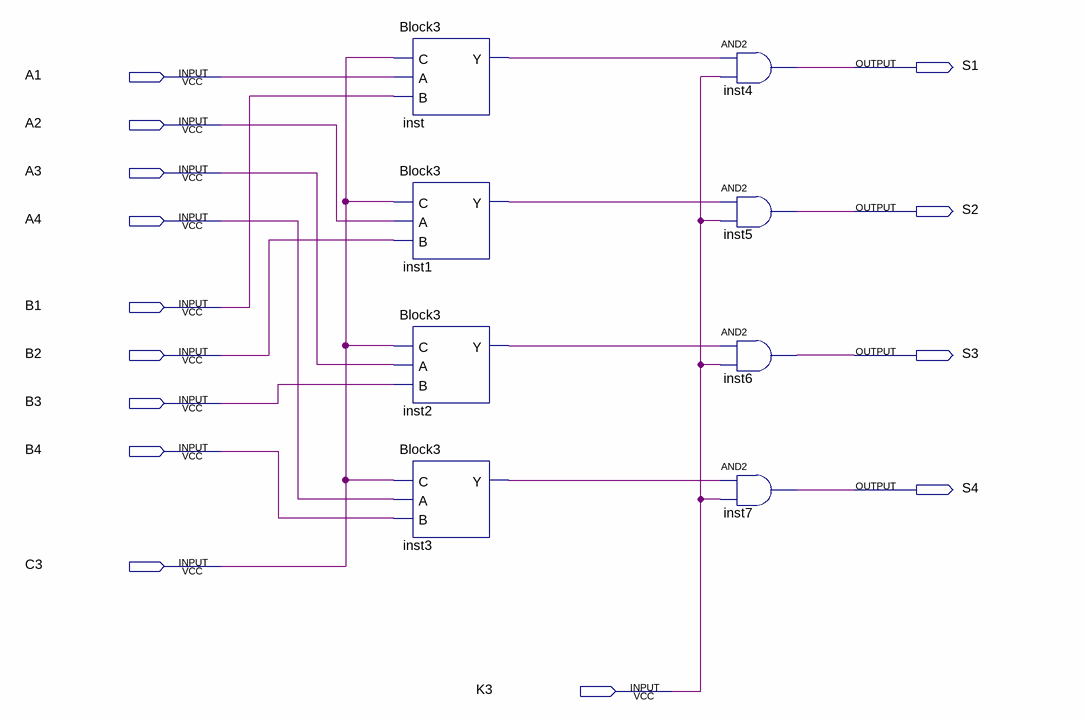
[diagram p0: schematic sheet]
// Quartus schematic Block4.bdf as structural Verilog: 8 symbols, 14 pins
module Block4 (
  input  A1,
  input  A2,
  input  A3,
  input  A4,
  input  B1,
  input  B2,
  input  B3,
  input  B4,
  input  C3,
  input  K3,
  output S1,
  output S2,
  output S3,
  output S4
);

  wire inst1_y, inst2_y, inst3_y, inst_y;

  Block3 inst (.C(C3), .A(A1), .B(B1), .Y(inst_y));
  Block3 inst1 (.C(C3), .A(A2), .B(B2), .Y(inst1_y));
  Block3 inst2 (.C(C3), .A(A3), .B(B3), .Y(inst2_y));
  Block3 inst3 (.C(C3), .A(A4), .B(B4), .Y(inst3_y));
  and inst4 (S1, inst_y, K3);
  and inst5 (S2, inst1_y, K3);
  and inst6 (S3, inst2_y, K3);
  and inst7 (S4, inst3_y, K3);
endmodule
